# Altium schematic sheet FrontControls.SchDoc
size A3
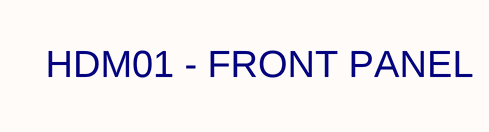
[diagram p0: FrontControls.SchDoc]

## Notes on the sheet
- HDM01 - FRONT PANEL